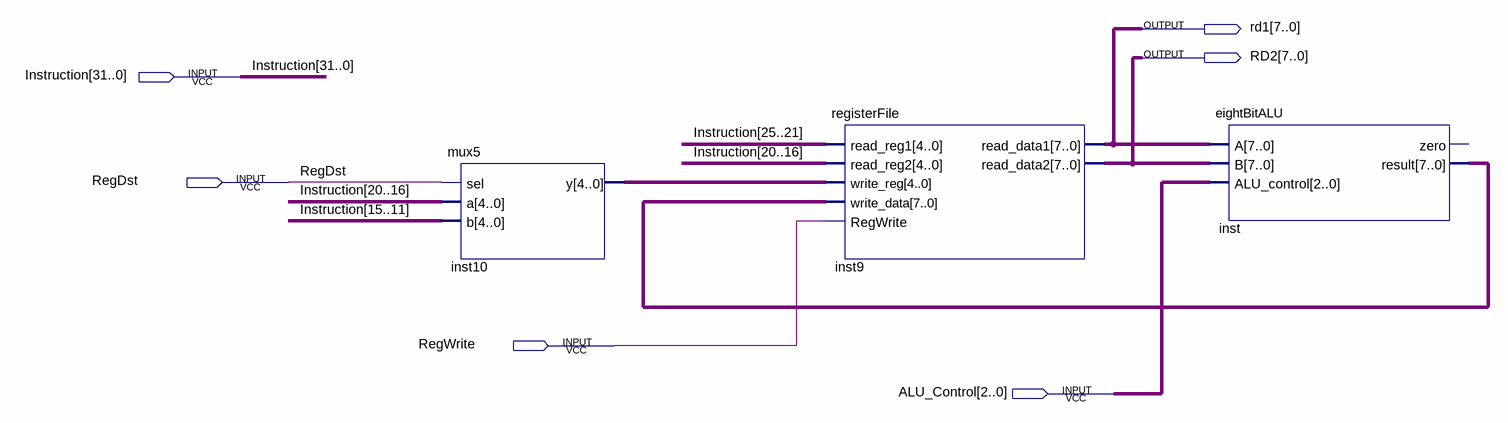
[diagram p0: schematic sheet]
// Quartus schematic TestingRtype.bdf as structural Verilog: 3 symbols, 6 pins
module TestingRtype (
  input  [31:0] Instruction,
  input  RegDst,
  input  RegWrite,
  input  [2:0] ALU_Control,
  output [7:0] rd1,
  output [7:0] RD2
);

  wire [4:0] inst10_y;
  wire [7:0] inst_result;

  mux5 inst10 (.sel(RegDst), .a(Instruction[20:16]), .b(Instruction[15:11]), .y(inst10_y));
  registerFile inst9 (
    .read_reg1(Instruction[25:21]), .read_reg2(Instruction[20:16]), .write_reg(inst10_y),
    .write_data(inst_result), .RegWrite(RegWrite), .read_data1(rd1), .read_data2(RD2));
  eightBitALU inst (.A(rd1), .B(RD2), .ALU_control(ALU_Control), .result(inst_result));  // open: zero
endmodule
